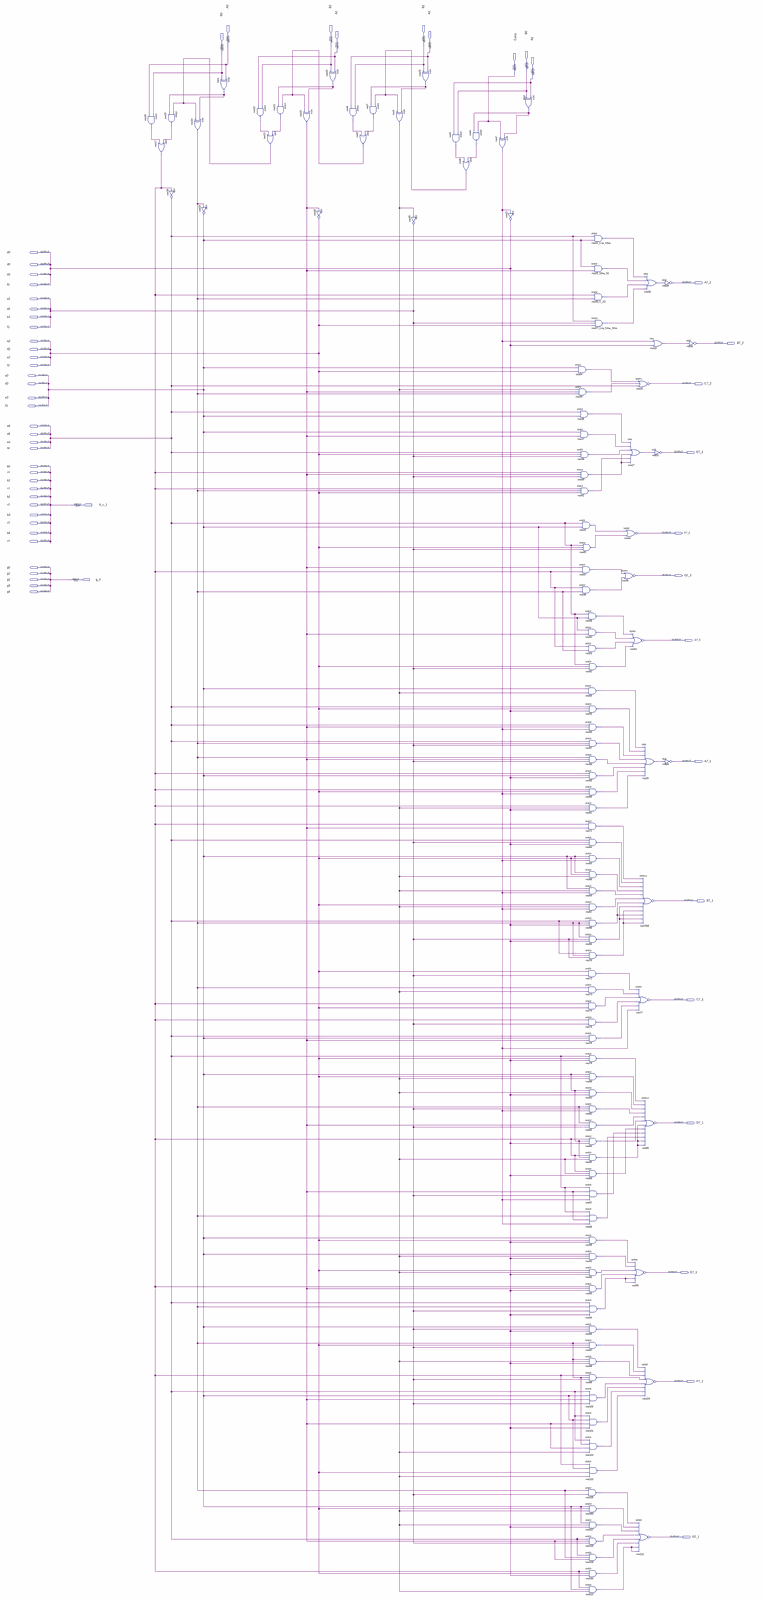
[diagram p0: schematic sheet, whole]
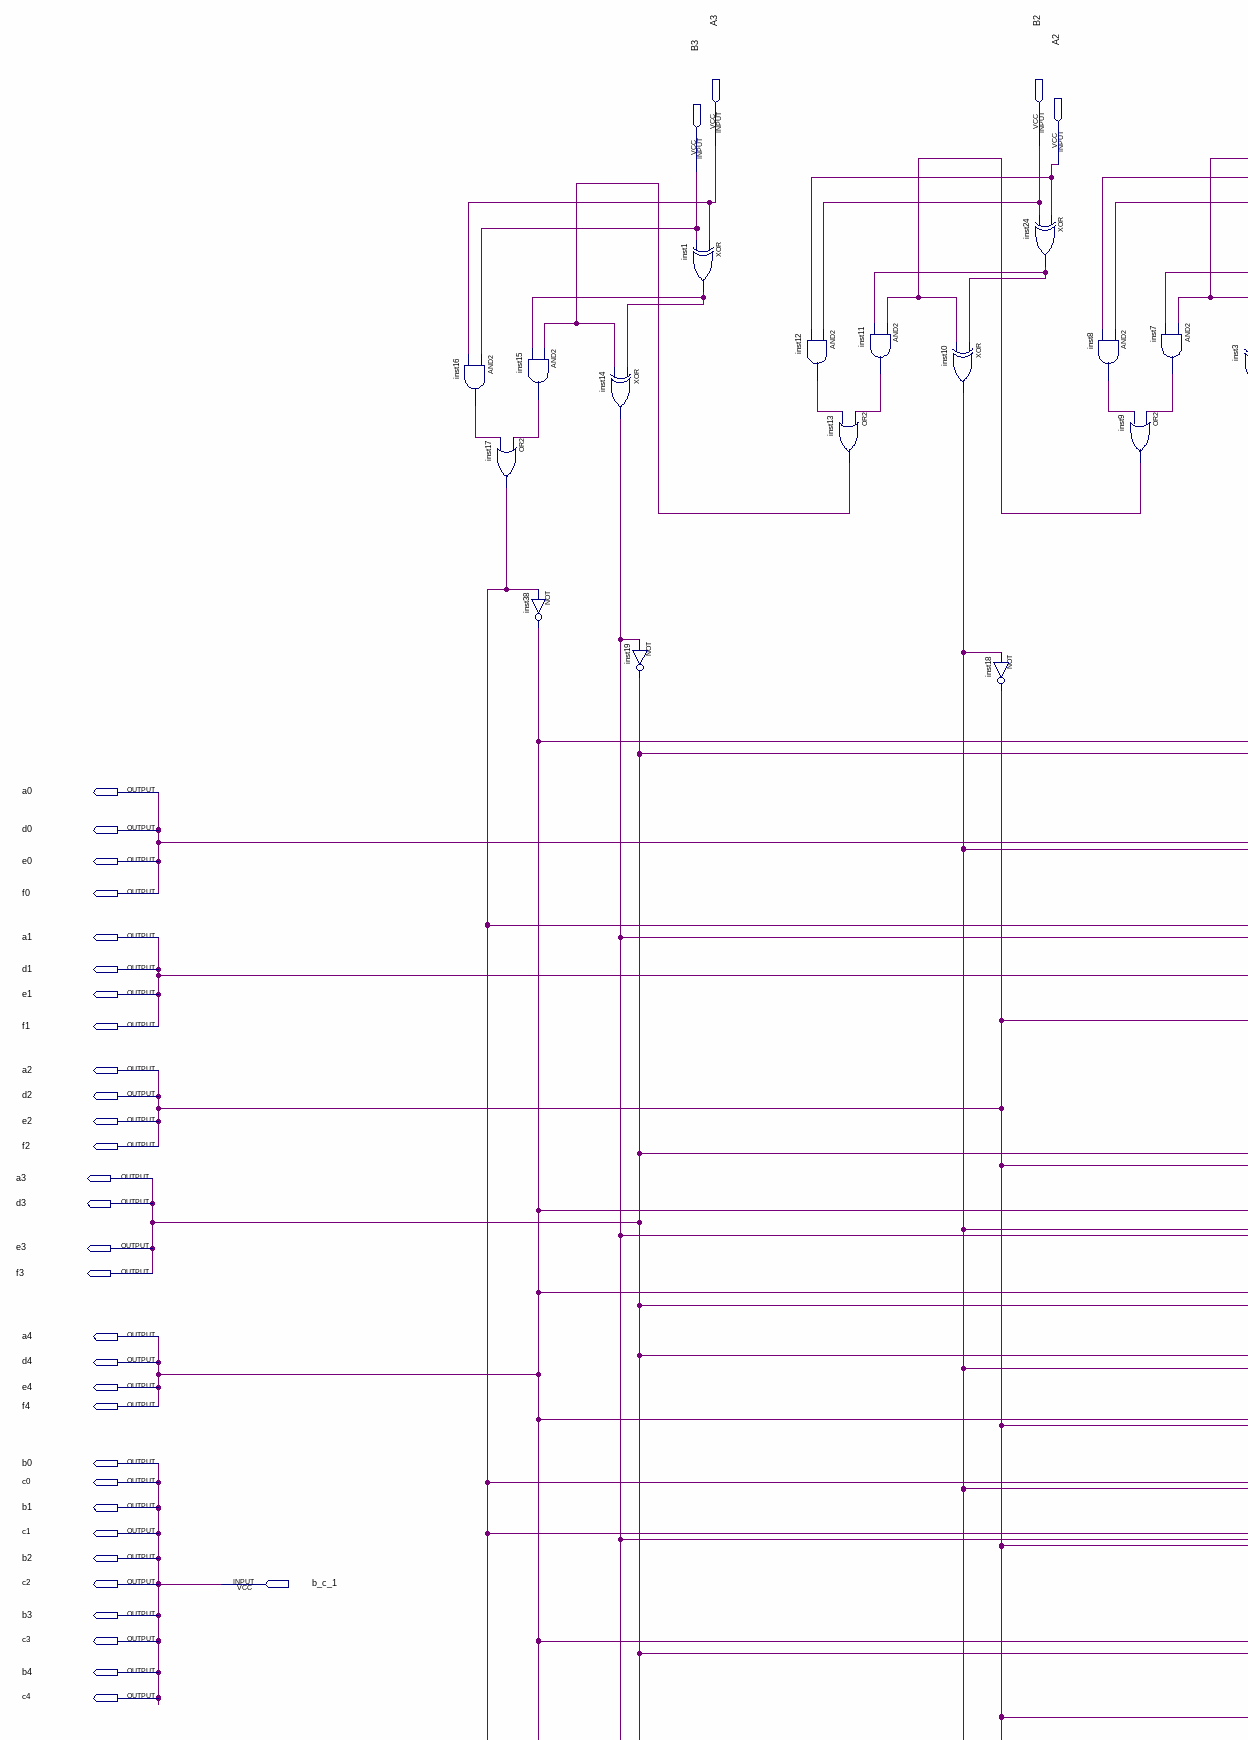
[diagram p1: schematic sheet, upper left part]
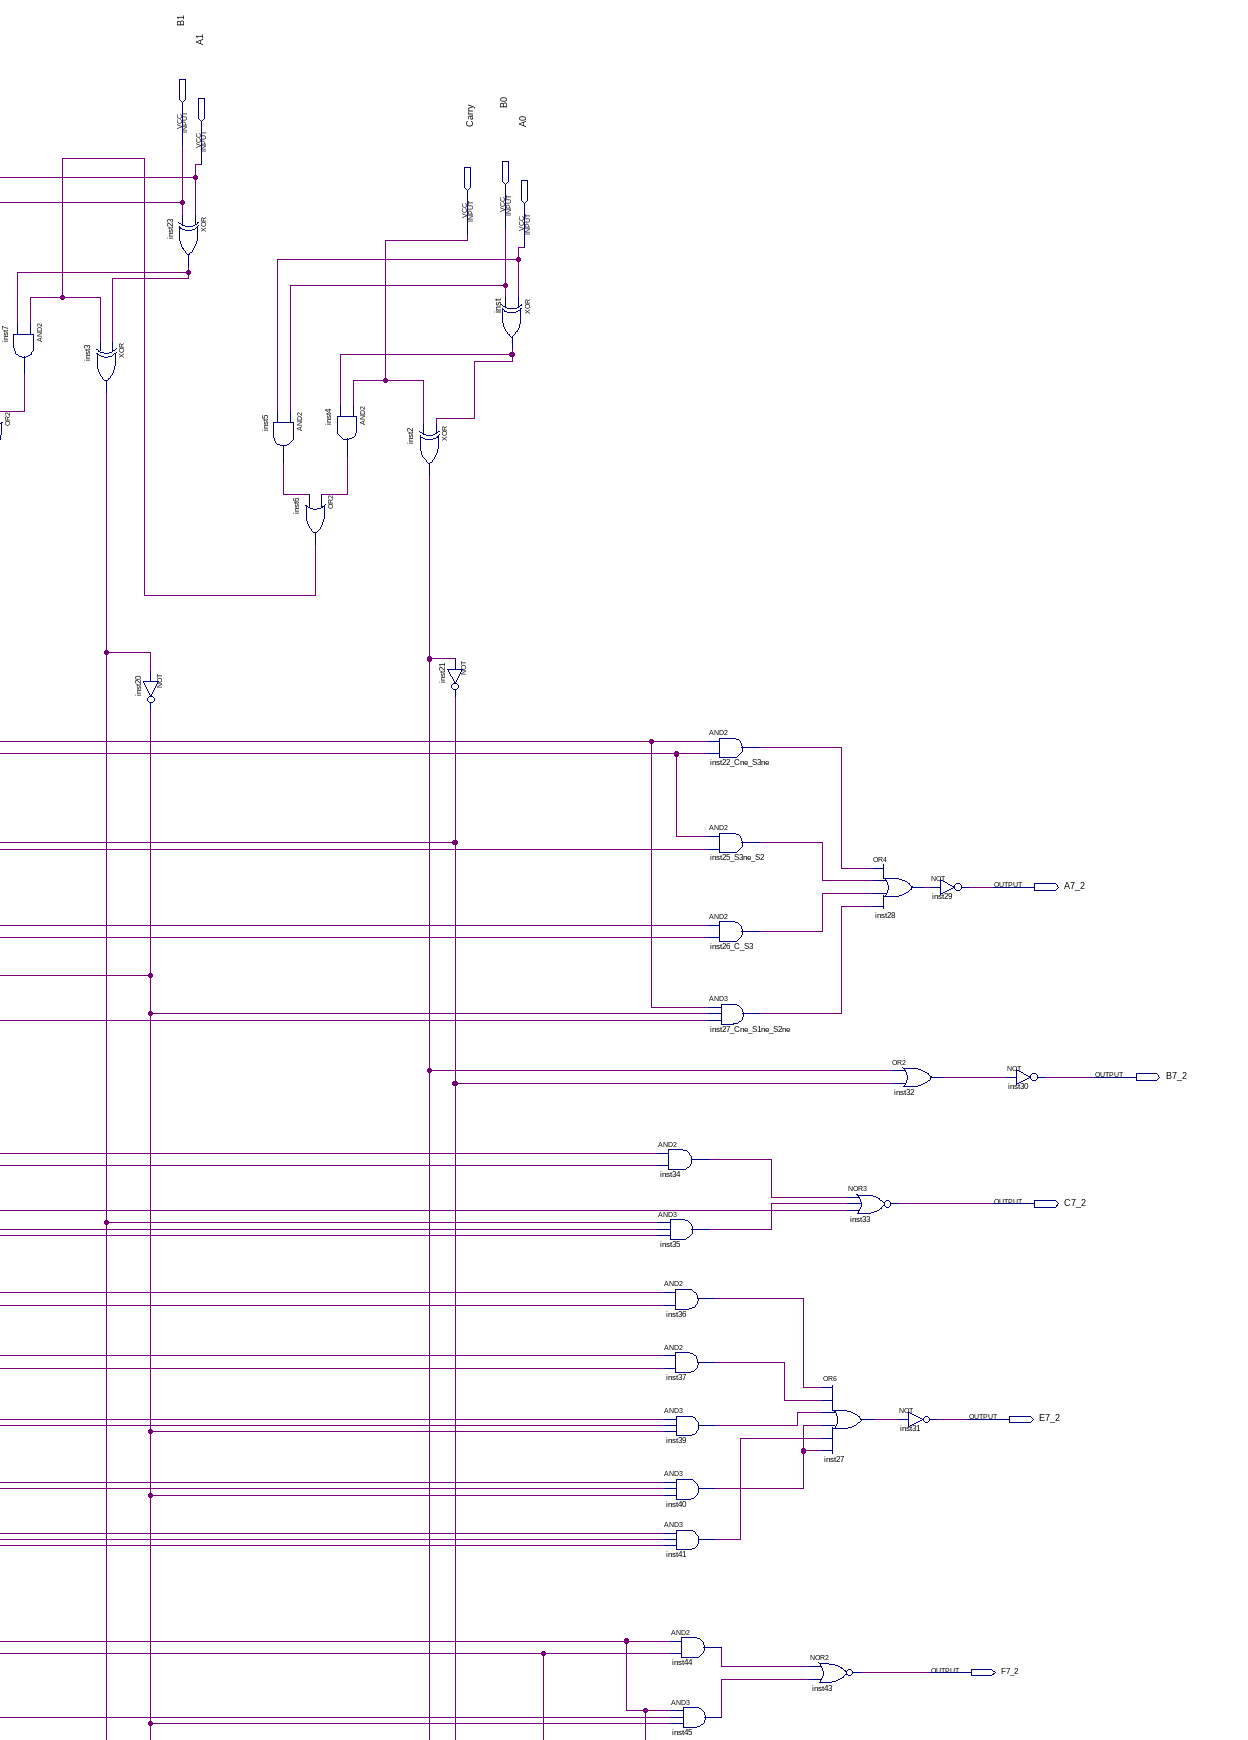
[diagram p2: schematic sheet, upper right part]
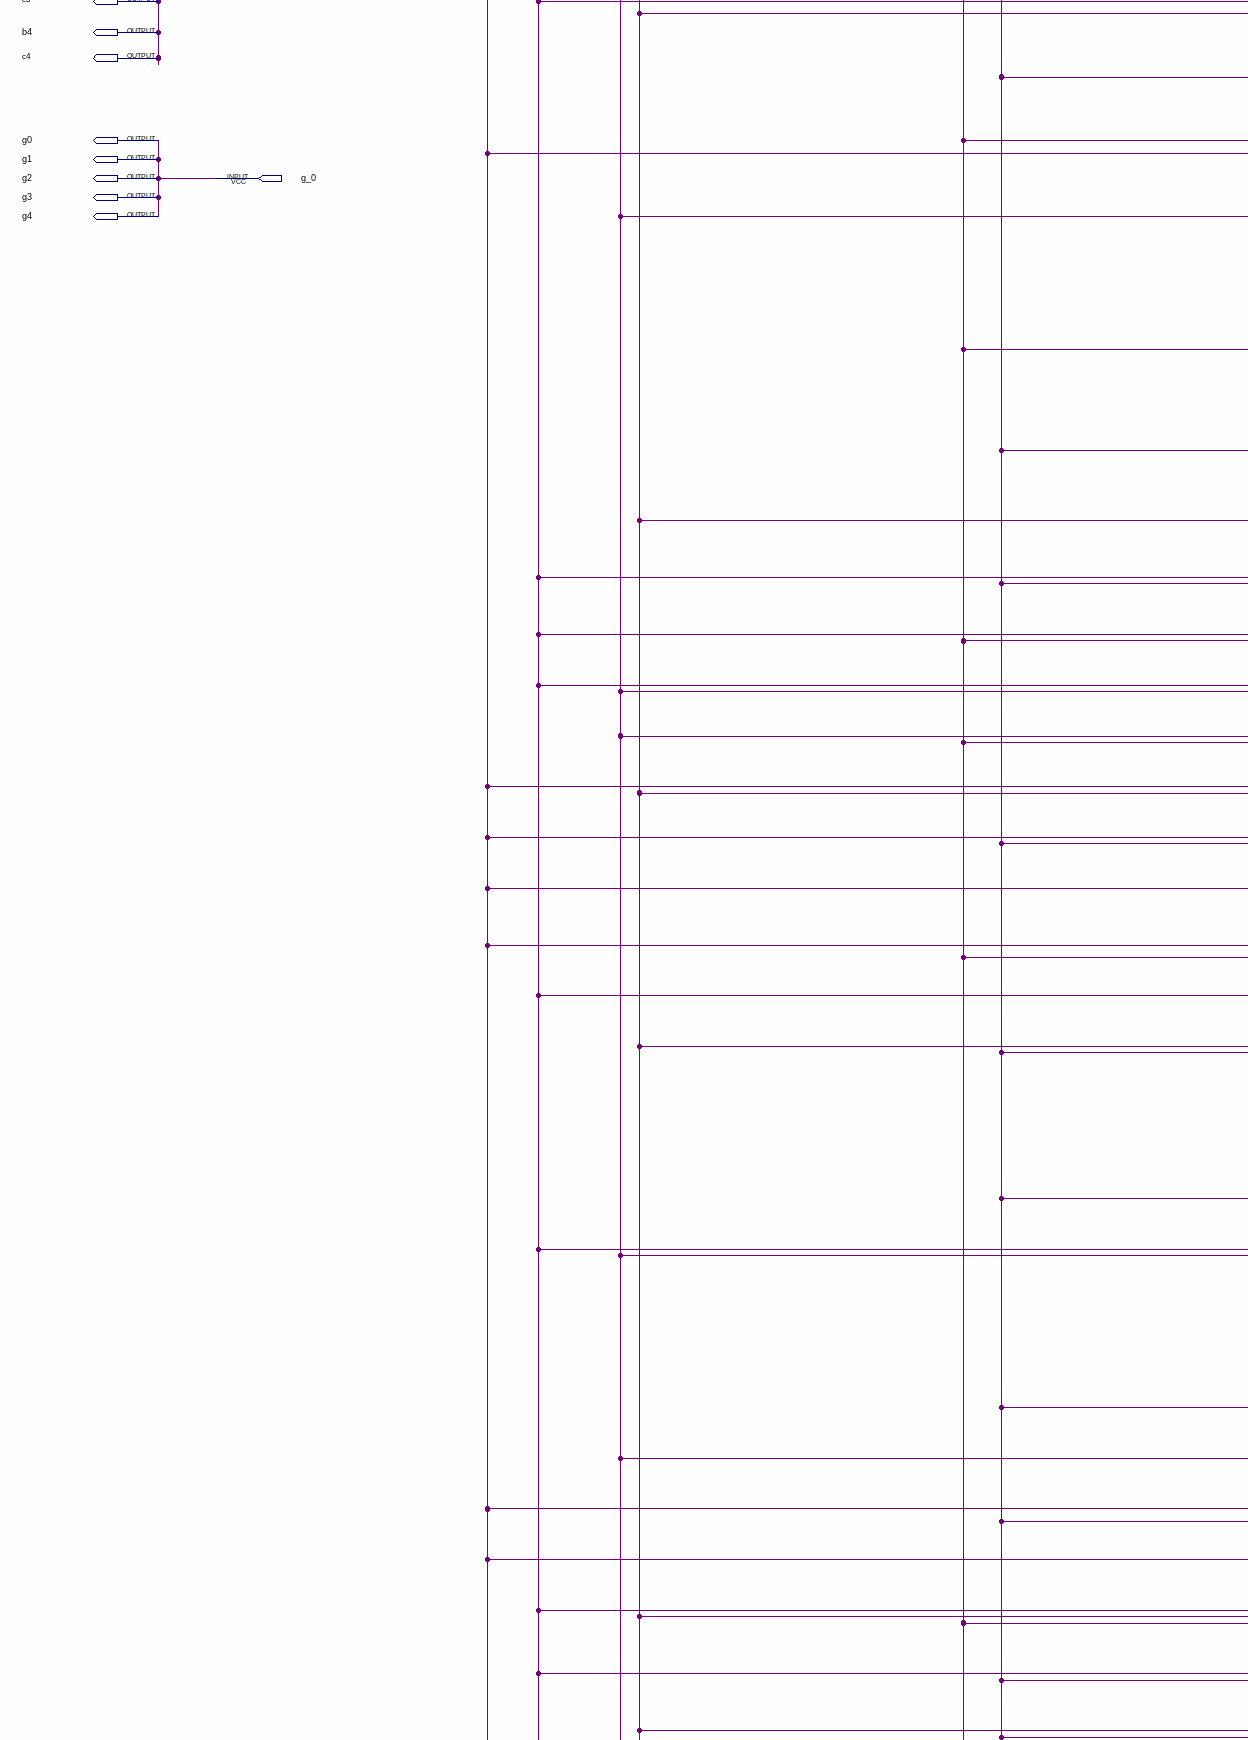
[diagram p3: schematic sheet, middle left part]
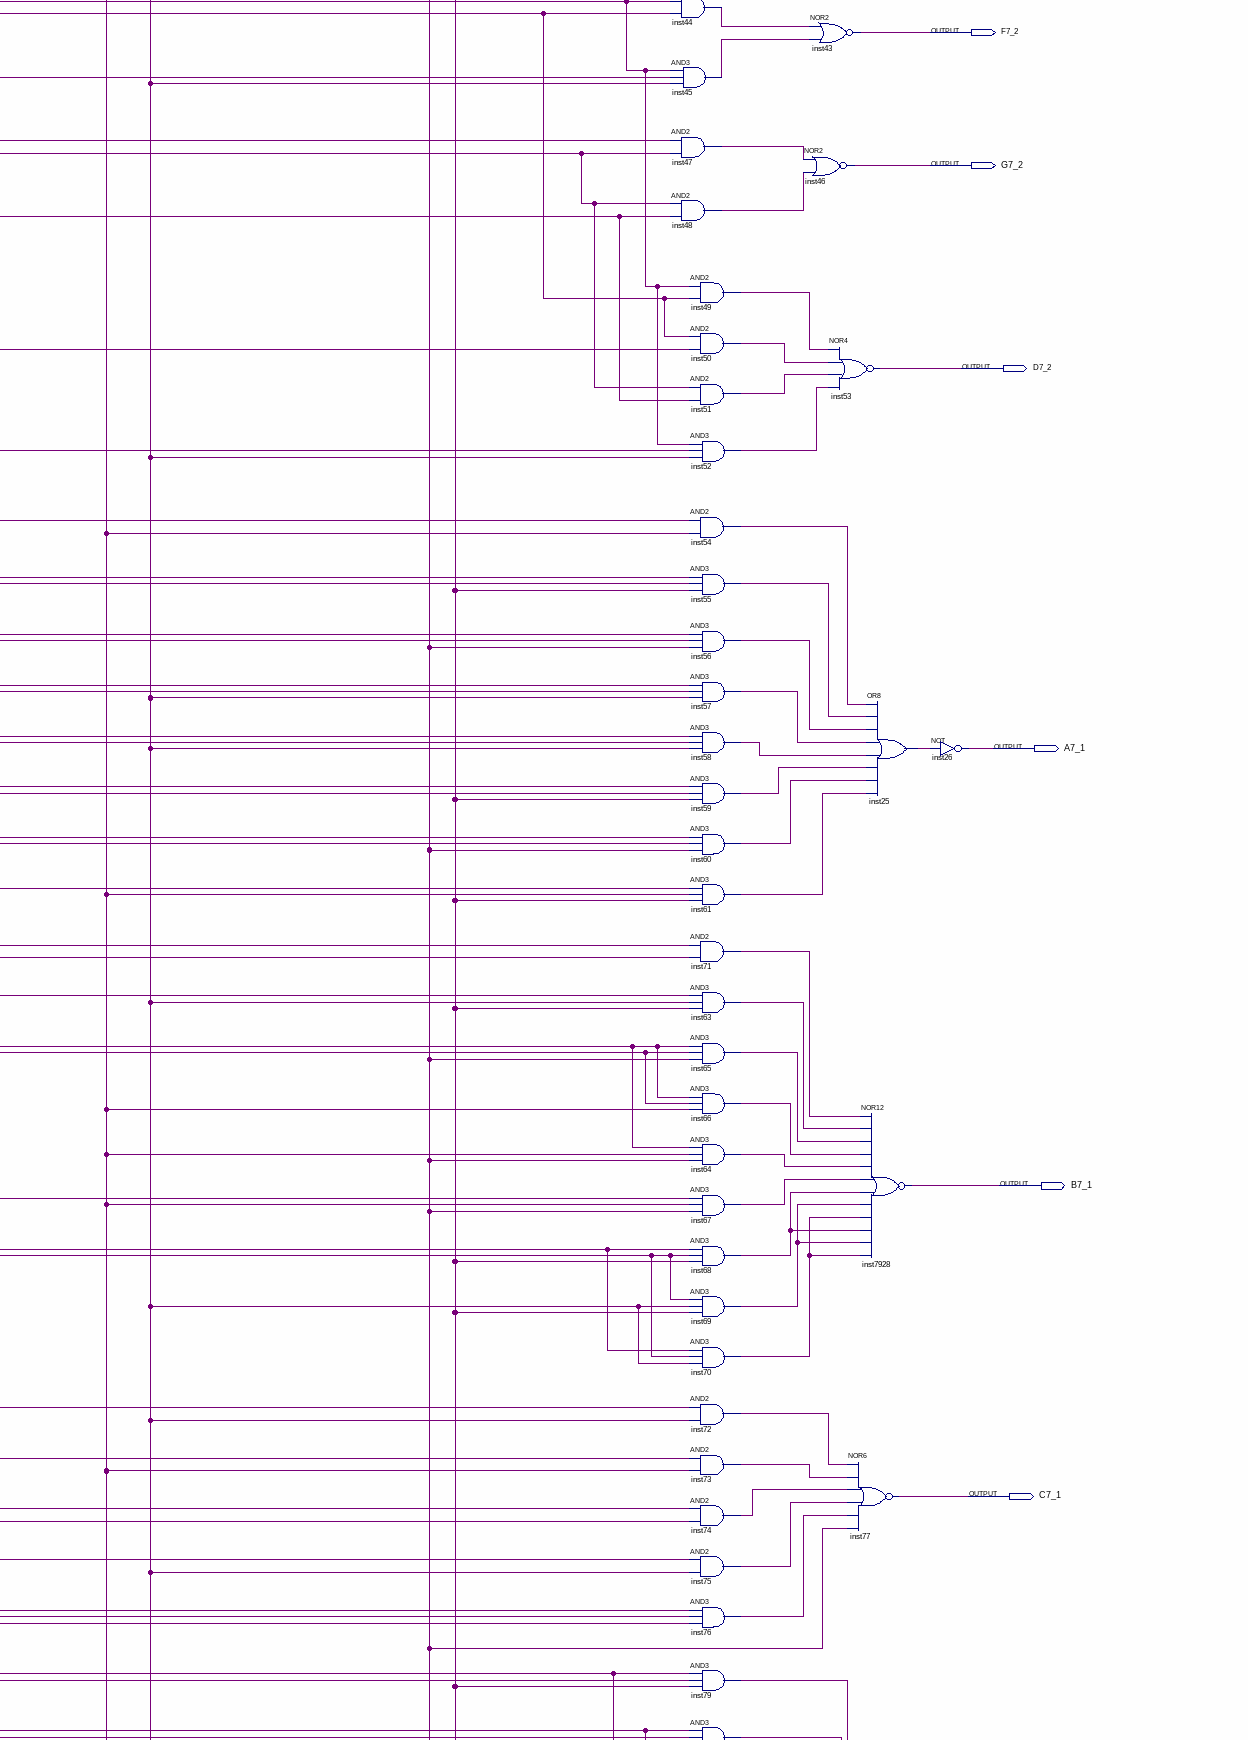
[diagram p4: schematic sheet, middle right part]
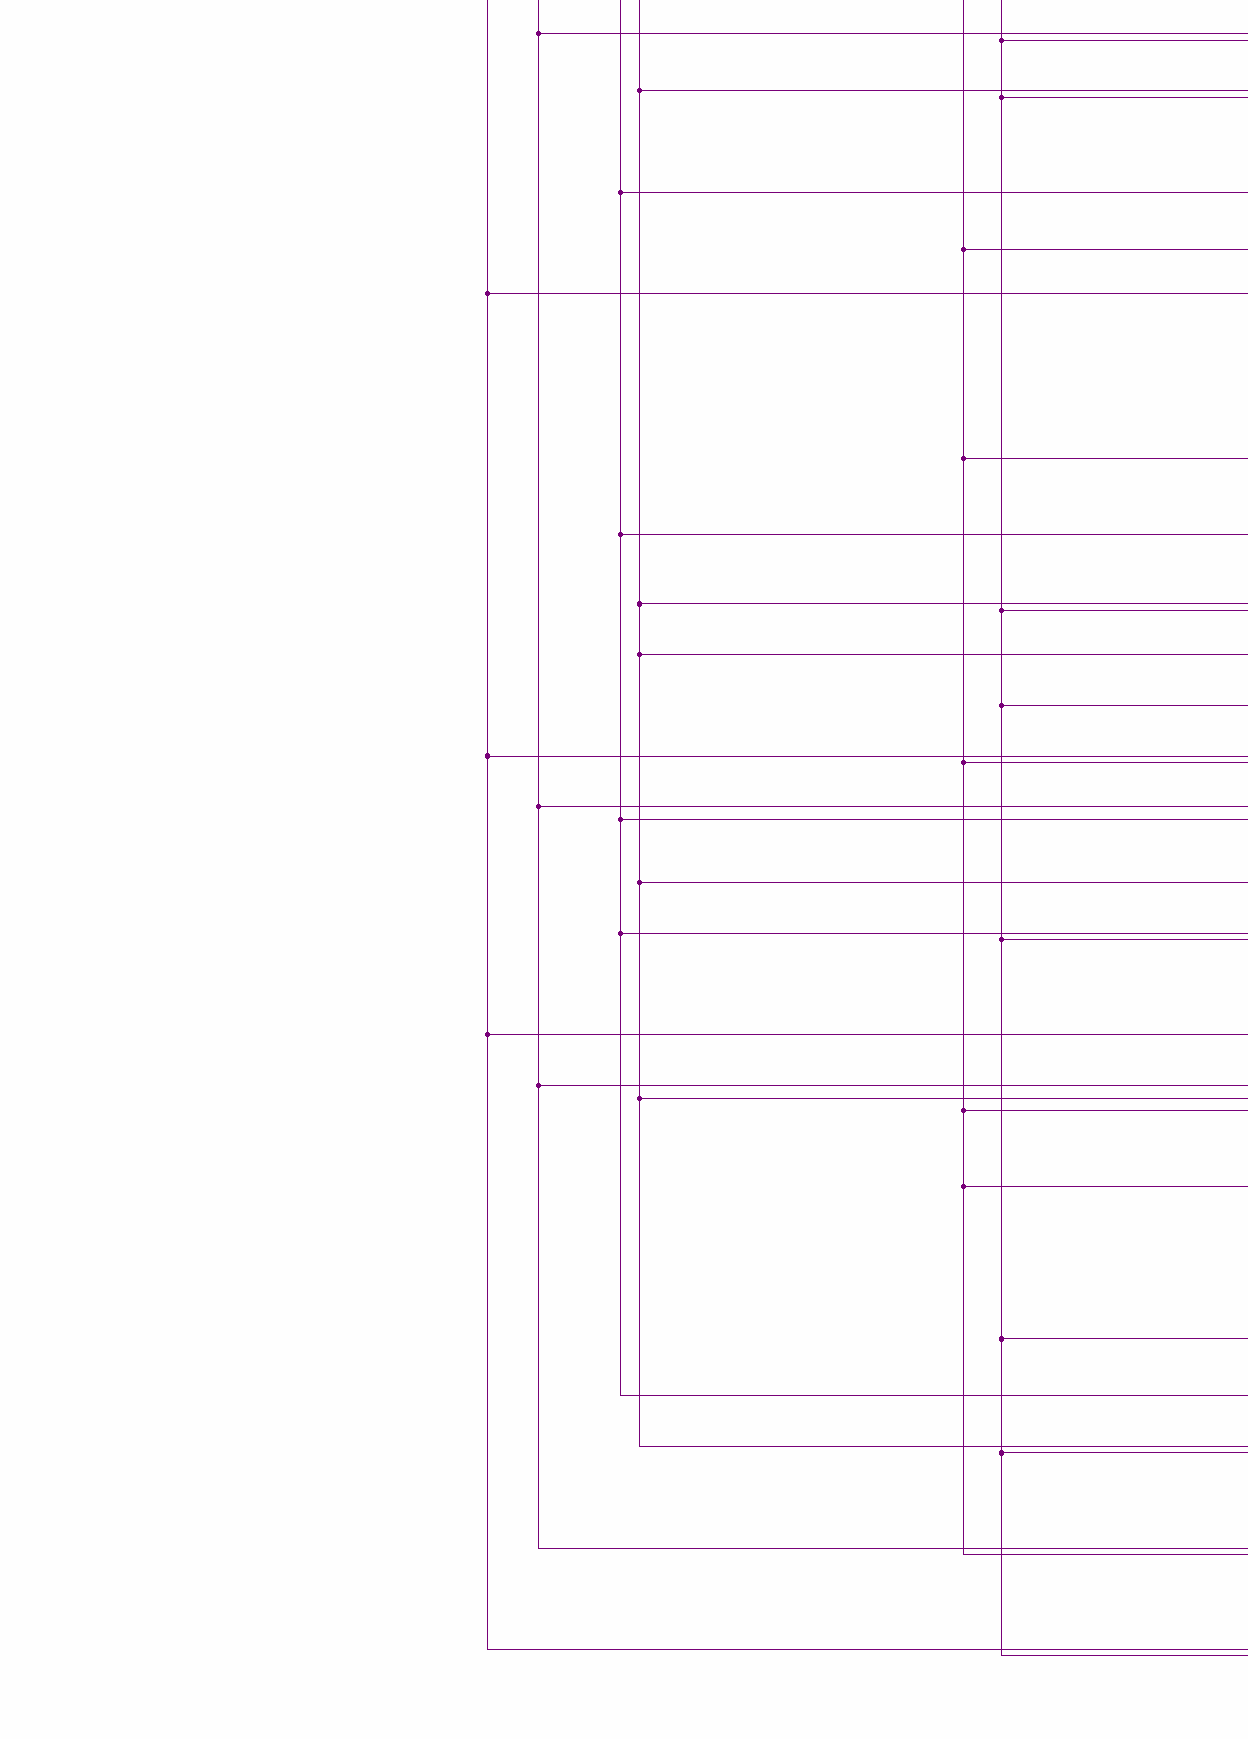
[diagram p5: schematic sheet, lower left part]
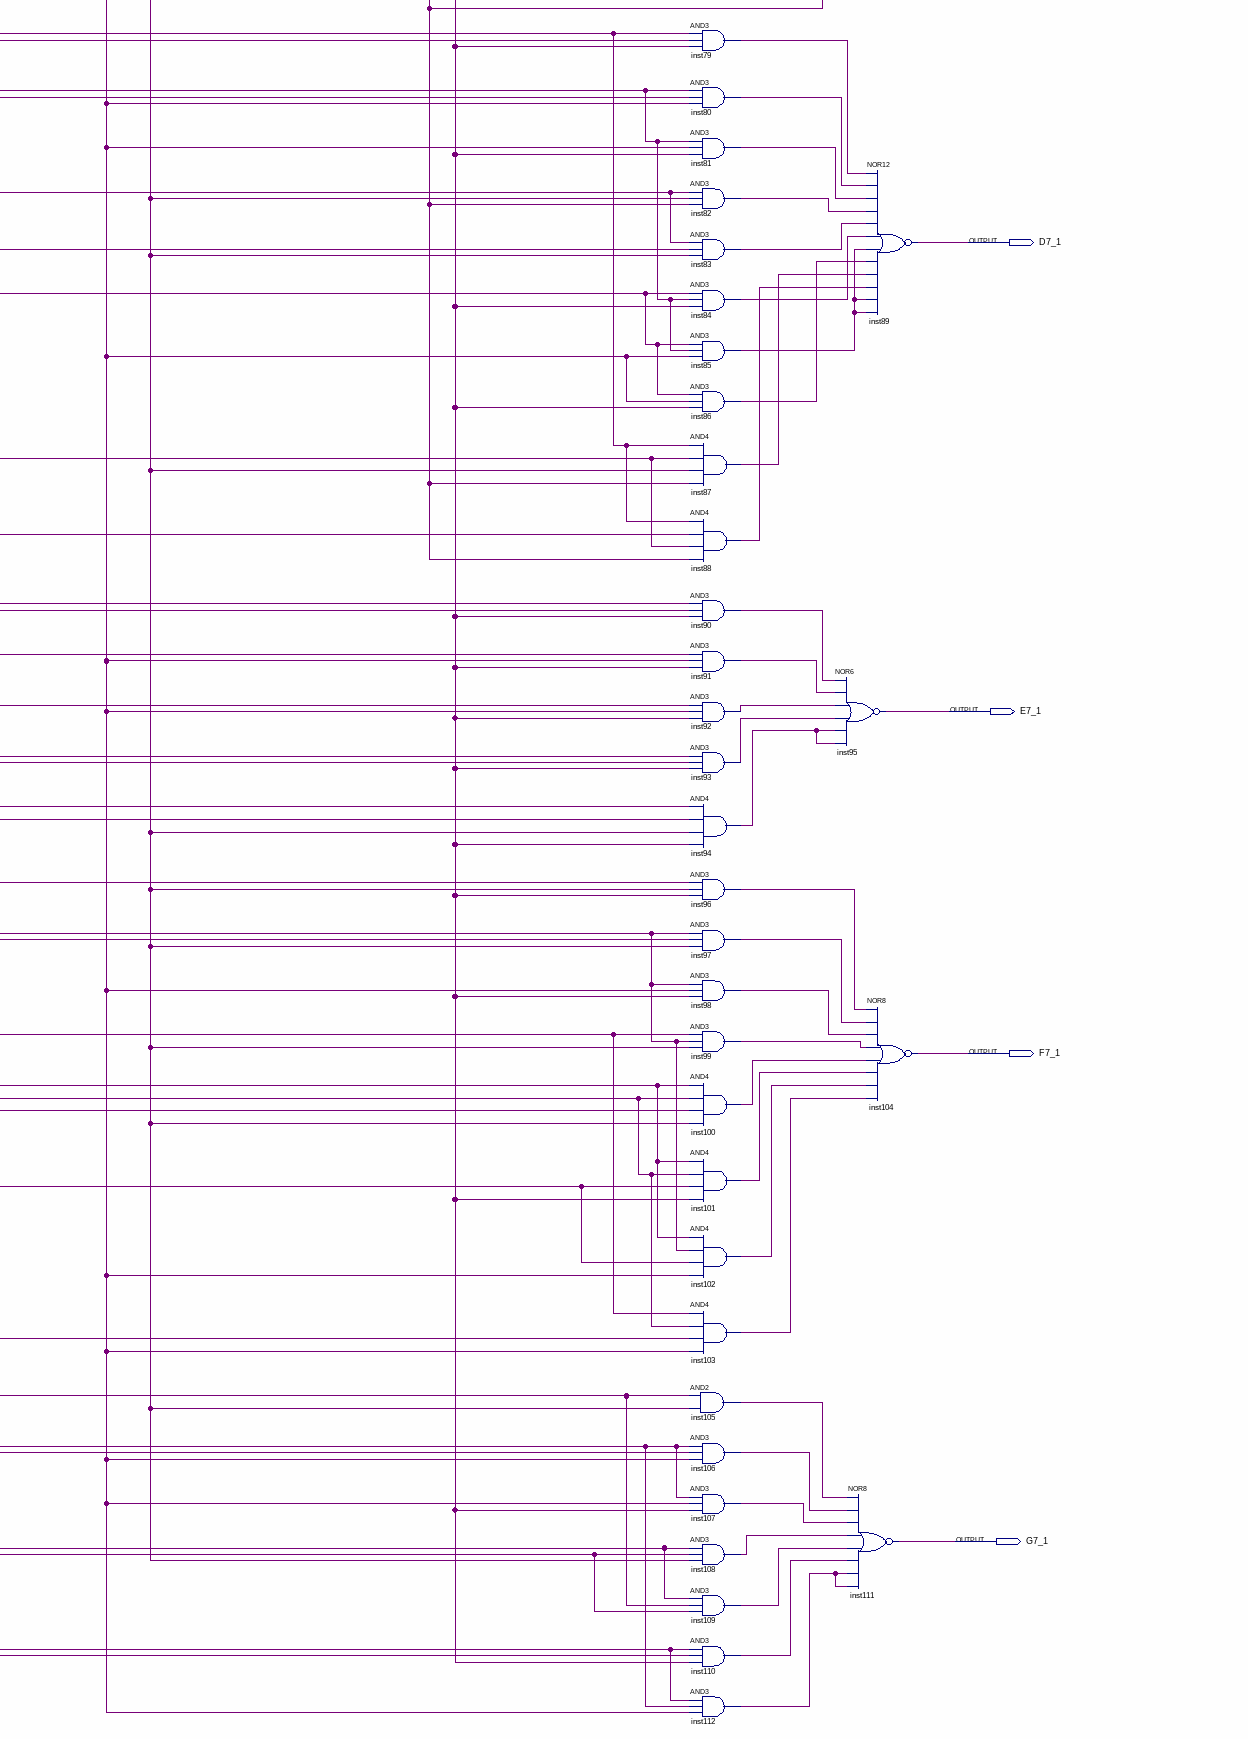
[diagram p6: schematic sheet, lower right part]
// Quartus schematic adder and subtractor.bdf as structural Verilog: 114 symbols, 60 pins
module \adder_and_subtractor  (
  inout  A3,
  inout  B2,
  inout  B1,
  inout  A2,
  inout  A1,
  inout  B3,
  inout  B0,
  input  Carry,
  inout  A0,
  input  b_c_1,
  input  g_0,
  output d0,
  output e0,
  output A7_2,
  output f0,
  output d1,
  output e1,
  output f1,
  output B7_2,
  output d2,
  output e2,
  output f2,
  output d3,
  output C7_2,
  output e3,
  output f3,
  output a4,
  output d4,
  output e4,
  output f4,
  output E7_2,
  output c0,
  output c1,
  output c2,
  output c3,
  output b4,
  output F7_2,
  output c4,
  output g0,
  output g1,
  output G7_2,
  output g2,
  output g3,
  output g4,
  output D7_2,
  output A7_1,
  output B7_1,
  output C7_1,
  output D7_1,
  output E7_1,
  output F7_1,
  output G7_1
);

  wire inst1_out, inst2_out, inst3_out, inst4_out, inst5_out, inst6_out, inst7_out, inst8_out, inst9_out,
       inst10_out, inst11_out, inst12_out, inst13_out, inst14_out, inst15_out, inst16_out, inst17_out,
       inst22_Cne_S3ne_out, inst23_out, inst24_out, inst25_out, inst25_S3ne_S2_out, inst26_C_S3_out,
       inst27_Cne_S1ne_S2ne_out, inst27_out, inst28_out, inst32_out, inst34_out, inst35_out, inst36_out,
       inst37_out, inst39_out, inst40_out, inst41_out, inst44_out, inst45_out, inst47_out, inst48_out,
       inst49_out, inst50_out, inst51_out, inst52_out, inst54_out, inst55_out, inst56_out, inst57_out,
       inst58_out, inst59_out, inst60_out, inst61_out, inst63_out, inst64_out, inst65_out, inst66_out,
       inst67_out, inst68_out, inst69_out, inst70_out, inst71_out, inst72_out, inst73_out, inst74_out,
       inst75_out, inst76_out, inst79_out, inst80_out, inst81_out, inst82_out, inst83_out, inst84_out,
       inst85_out, inst86_out, inst87_out, inst88_out, inst90_out, inst91_out, inst92_out, inst93_out,
       inst94_out, inst96_out, inst97_out, inst98_out, inst99_out, inst100_out, inst101_out, inst102_out,
       inst103_out, inst105_out, inst106_out, inst107_out, inst108_out, inst109_out, inst110_out,
       inst112_out, inst_out;

  and inst16 (inst16_out, B0, A3);
  and inst15 (inst15_out, inst13_out, inst1_out);
  or inst17 (inst17_out, inst15_out, inst16_out);
  not inst38 (a4, inst17_out);
  xor inst14 (inst14_out, inst1_out, inst13_out);
  not inst19 (A3, inst14_out);
  xor inst1 (inst1_out, A3, B0);
  and inst12 (inst12_out, B0, A2);
  or inst13 (inst13_out, inst11_out, inst12_out);
  and inst11 (inst11_out, inst9_out, inst24_out);
  xor inst10 (inst10_out, inst24_out, inst9_out);
  not inst18 (A2, inst10_out);
  xor inst24 (inst24_out, A2, B0);
  and inst8 (inst8_out, B0, A1);
  or inst9 (inst9_out, inst7_out, inst8_out);
  and inst7 (inst7_out, inst6_out, inst23_out);
  xor inst3 (inst3_out, inst23_out, inst6_out);
  not inst20 (A1, inst3_out);
  xor inst23 (inst23_out, A1, B0);
  and inst5 (inst5_out, B0, A0);
  or inst6 (inst6_out, inst4_out, inst5_out);
  and inst4 (inst4_out, Carry, inst_out);
  xor inst2 (inst2_out, inst_out, Carry);
  not inst21 (A0, inst2_out);
  xor inst (inst_out, A0, B0);
  and inst34 (inst34_out, A3, A2);
  and inst35 (inst35_out, inst3_out, inst10_out, inst14_out);
  and inst36 (inst36_out, a4, A3);
  and inst37 (inst37_out, A3, inst10_out);
  and inst39 (inst39_out, a4, A2, A1);
  and inst40 (inst40_out, inst17_out, inst10_out, A1);
  and inst41 (inst41_out, inst17_out, inst14_out, A2);
  and inst44 (inst44_out, a4, A3);
  and inst45 (inst45_out, a4, A2, A1);
  and inst47 (inst47_out, inst10_out, inst17_out);
  and inst48 (inst48_out, inst17_out, inst14_out);
  and inst49 (inst49_out, a4, A3);
  and inst50 (inst50_out, A3, inst10_out);
  and inst51 (inst51_out, inst17_out, inst14_out);
  and inst52 (inst52_out, a4, A2, A1);
  and inst54 (inst54_out, A3, inst3_out);
  and inst55 (inst55_out, a4, A2, A0);
  and inst56 (inst56_out, a4, inst10_out, inst2_out);
  and inst57 (inst57_out, a4, inst14_out, A1);
  and inst58 (inst58_out, inst14_out, inst10_out, A1);
  and inst59 (inst59_out, inst17_out, A3, A0);
  and inst60 (inst60_out, inst17_out, A2, inst2_out);
  and inst61 (inst61_out, inst17_out, inst3_out, A0);
  and inst71 (inst71_out, inst17_out, inst10_out);
  and inst63 (inst63_out, a4, A1, A0);
  and inst65 (inst65_out, A3, A2, inst2_out);
  and inst66 (inst66_out, A3, A2, inst3_out);
  and inst64 (inst64_out, A3, inst3_out, inst2_out);
  and inst67 (inst67_out, A2, inst3_out, inst2_out);
  and inst68 (inst68_out, a4, inst14_out, A0);
  and inst69 (inst69_out, inst14_out, A1, A0);
  and inst70 (inst70_out, a4, inst14_out, A1);
  and inst72 (inst72_out, A2, A1);
  and inst73 (inst73_out, inst14_out, inst3_out);
  and inst74 (inst74_out, inst17_out, A2);
  and inst75 (inst75_out, inst17_out, A1);
  and inst76 (inst76_out, a4, A3, inst10_out);
  and inst79 (inst79_out, a4, A2, A0);
  and inst80 (inst80_out, A3, A2, inst3_out);
  and inst81 (inst81_out, A3, inst3_out, A0);
  and inst82 (inst82_out, inst14_out, A1, inst2_out);
  and inst83 (inst83_out, inst14_out, inst10_out, A1);
  and inst84 (inst84_out, inst17_out, A3, A0);
  and inst85 (inst85_out, inst17_out, A3, inst3_out);
  and inst86 (inst86_out, inst17_out, inst3_out, A0);
  and inst87 (inst87_out, a4, inst10_out, A1, inst2_out);
  and inst88 (inst88_out, a4, inst14_out, inst10_out, inst2_out);
  and inst90 (inst90_out, A3, A2, A0);
  and inst91 (inst91_out, A3, inst3_out, A0);
  and inst92 (inst92_out, A2, inst3_out, A0);
  and inst93 (inst93_out, inst17_out, inst10_out, A0);
  and inst94 (inst94_out, a4, inst14_out, A1, A0);
  and inst96 (inst96_out, A3, A1, A0);
  and inst97 (inst97_out, inst14_out, A2, A1);
  and inst98 (inst98_out, inst14_out, inst3_out, A0);
  and inst99 (inst99_out, inst17_out, inst14_out, A1);
  and inst100 (inst100_out, a4, A3, inst10_out, A1);
  and inst101 (inst101_out, a4, A3, inst10_out, A0);
  and inst102 (inst102_out, a4, inst14_out, inst10_out, inst3_out);
  and inst103 (inst103_out, inst17_out, A3, A2, inst3_out);
  and inst105 (inst105_out, inst14_out, A1);
  and inst106 (inst106_out, A3, A2, inst3_out);
  and inst107 (inst107_out, A3, inst3_out, A0);
  and inst108 (inst108_out, a4, inst10_out, A1);
  and inst109 (inst109_out, a4, inst14_out, inst10_out);
  and inst110 (inst110_out, inst17_out, A2, A0);
  and inst112 (inst112_out, inst17_out, A3, inst3_out);
  and inst22_Cne_S3ne (inst22_Cne_S3ne_out, a4, A3);
  and inst25_S3ne_S2 (inst25_S3ne_S2_out, A3, inst10_out);
  and inst26_C_S3 (inst26_C_S3_out, inst17_out, inst14_out);
  and inst27_Cne_S1ne_S2ne (inst27_Cne_S1ne_S2ne_out, a4, A1, A2);
  nor inst46 (G7_2, inst47_out, inst48_out);
  nor inst33 (C7_2, inst34_out, inst35_out, a4);
  or inst27 (inst27_out, inst36_out, inst37_out, inst39_out, inst40_out, inst41_out, inst40_out);
  nor inst43 (F7_2, inst44_out, inst45_out);
  nor inst53 (D7_2, inst49_out, inst50_out, inst51_out, inst52_out);
  nor inst77 (C7_1, inst72_out, inst73_out, inst74_out, inst75_out, inst76_out, inst2_out);
  nor inst95 (E7_1, inst90_out, inst91_out, inst92_out, inst93_out, inst94_out, inst94_out);
  nor inst111 (G7_1, inst105_out, inst106_out, inst107_out, inst108_out, inst109_out, inst110_out, inst112_out, inst112_out);
  or inst28 (inst28_out, inst22_Cne_S3ne_out, inst25_S3ne_S2_out, inst26_C_S3_out, inst27_Cne_S1ne_S2ne_out);
  or inst32 (inst32_out, inst2_out, A0);
  not inst31 (E7_2, inst27_out);
  or inst25 (inst25_out, inst54_out, inst55_out, inst56_out, inst57_out, inst58_out, inst59_out, inst60_out, inst61_out);
  nor inst7928 (B7_1, inst71_out, inst63_out, inst65_out, inst66_out, inst64_out, inst67_out, inst68_out, inst69_out, inst70_out, inst68_out, inst69_out, inst70_out);
  nor inst89 (D7_1, inst79_out, inst80_out, inst81_out, inst82_out, inst83_out, inst84_out, inst85_out, inst86_out, inst87_out, inst88_out, inst85_out, inst85_out);
  nor inst104 (F7_1, inst96_out, inst97_out, inst98_out, inst99_out, inst100_out, inst101_out, inst102_out, inst103_out);
  not inst29 (A7_2, inst28_out);
  not inst26 (A7_1, inst25_out);
  not inst30 (B7_2, inst32_out);

  assign B1 = B0;
  assign B2 = B0;
  assign B3 = B0;
  assign b4 = B0;
  assign b_c_1 = B0;
  assign c0 = B0;
  assign c1 = B0;
  assign c2 = B0;
  assign c3 = B0;
  assign c4 = B0;
  assign d0 = A0;
  assign d1 = A1;
  assign d2 = A2;
  assign d3 = A3;
  assign d4 = a4;
  assign e0 = A0;
  assign e1 = A1;
  assign e2 = A2;
  assign e3 = A3;
  assign e4 = a4;
  assign f0 = A0;
  assign f1 = A1;
  assign f2 = A2;
  assign f3 = A3;
  assign f4 = a4;
  assign g0 = g_0;
  assign g1 = g_0;
  assign g2 = g_0;
  assign g3 = g_0;
  assign g4 = g_0;
endmodule
